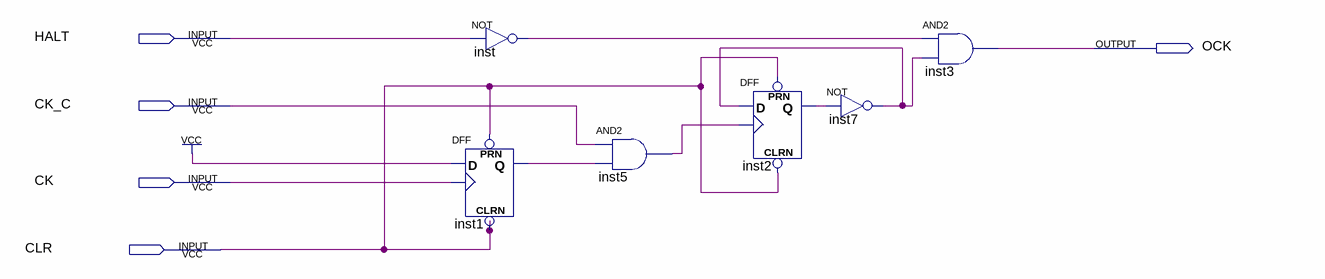
[diagram p0: schematic sheet]
// Quartus schematic start.bdf as structural Verilog: 6 symbols, 5 pins
module start (
  input  HALT,
  input  CK_C,
  input  CK,
  input  CLR,
  output OCK
);

  wire inst1_q, inst2_q, inst5_out, inst7_out, inst_out;

  not inst (inst_out, HALT);
  DFF inst1 (.CLRN(CLR), .CLK(CK), .D(1'b1), .PRN(CLR), .Q(inst1_q));
  and inst5 (inst5_out, CK_C, inst1_q);
  DFF inst2 (.CLRN(CLR), .CLK(inst5_out), .D(inst7_out), .PRN(CLR), .Q(inst2_q));
  not inst7 (inst7_out, inst2_q);
  and inst3 (OCK, inst_out, inst7_out);
endmodule
